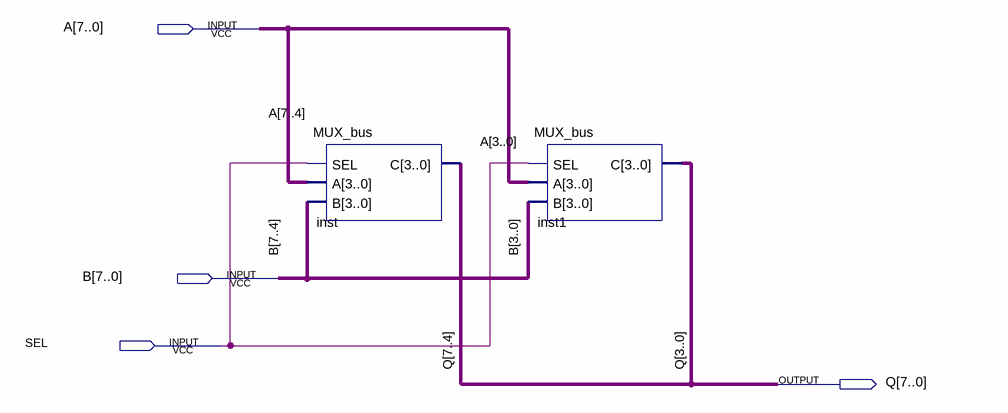
[diagram p0: schematic sheet]
// Quartus schematic MUX8bit2way.bdf as structural Verilog: 2 symbols, 4 pins
module MUX8bit2way (
  input  [7:0] A,
  input  [7:0] B,
  input  SEL,
  output [7:0] Q
);

  MUX_bus inst (.SEL(SEL), .A(A[7:4]), .B(B[7:4]), .C(Q[7:4]));
  MUX_bus inst1 (.SEL(SEL), .A(A[3:0]), .B(B[3:0]), .C(Q[3:0]));
endmodule
